# EAGLE design motor_shield (EAGLE 7.2.0)
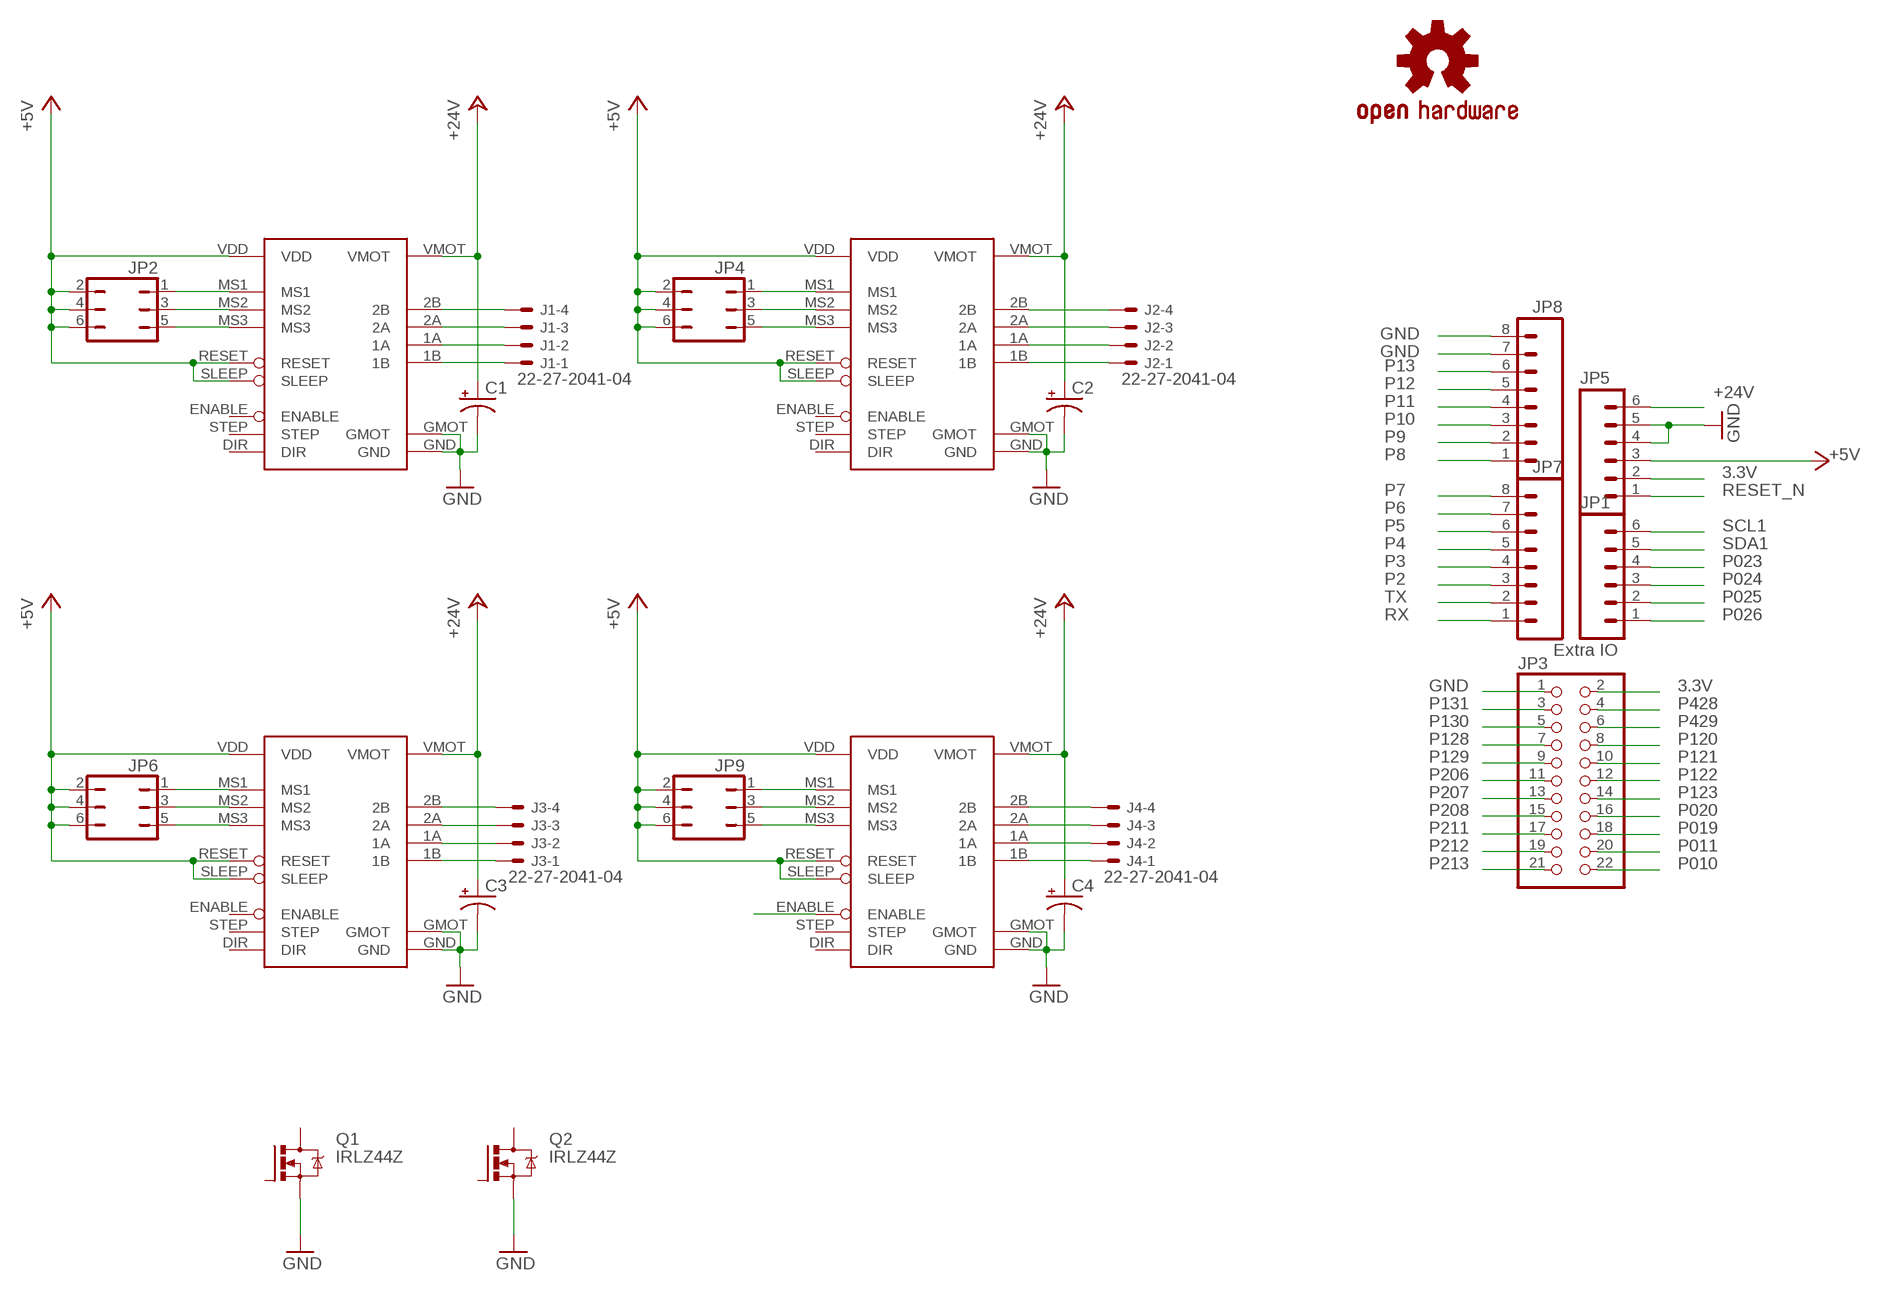
[diagram p0: schematic, sheet 1]

## Parts
C1  CAP_POLPTH1  [CPOL-RADIAL-100UF-25V]
C2  CAP_POLPTH1  [CPOL-RADIAL-100UF-25V]
C3  CAP_POLPTH1  [CPOL-RADIAL-100UF-25V]
C4  CAP_POLPTH1  [CPOL-RADIAL-100UF-25V]
J1  22-27-2041-04  [6410-04]
J2  22-27-2041-04  [6410-04]
J3  22-27-2041-04  [6410-04]
J4  22-27-2041-04  [6410-04]
JP1  M06SIP  [1X06]
JP2  JP3Q  [JP3Q]
JP3  PINHD-2X11  [2X11]
JP4  JP3Q  [JP3Q]
JP5  M06SIP  [1X06]
JP6  JP3Q  [JP3Q]
JP7  M08  [1X08]
JP8  M08  [1X08]
JP9  JP3Q  [JP3Q]
OPENHARDWARE  OSHW-LOGOL  [OSHW-LOGO-L]
Q1  IRLZ44Z  [TO220BH]
Q2  IRLZ44Z  [TO220BH]
U$1  A4988  [A4988]
U$2  A4988  [A4988]
U$3  A4988  [A4988]
U$4  A4988  [A4988]

## Nets
3.3V: JP3.2 JP5.2
+5V: JP2.2 JP2.4 JP2.6 JP4.2 JP4.4 JP4.6 JP5.3 JP6.2 JP6.4 JP6.6 JP9.2 JP9.4 JP9.6 U$1.RESET U$1.SLEEP U$1.VDD U$2.RESET U$2.SLEEP U$2.VDD U$3.RESET U$3.SLEEP U$3.VDD U$4.RESET U$4.SLEEP U$4.VDD
+24V: C1.1(+) C2.1(+) C3.1(+) C4.1(+) JP5.6 U$1.VMOT U$2.VMOT U$3.VMOT U$4.VMOT
GND: C1.2(-) C2.2(-) C3.2(-) C4.2(-) JP3.1 JP5.4 JP5.5 JP8.7 JP8.8 Q1.S Q2.S U$1.GMOT U$1.GND U$2.GMOT U$2.GND U$3.GMOT U$3.GND U$4.GMOT U$4.GND
N$1: J1.4 U$1.2B
N$2: J1.3 U$1.2A
N$3: J1.2 U$1.1A
N$4: J1.1 U$1.1B
N$5: JP2.1 U$1.MS1
N$6: JP2.3 U$1.MS2
N$7: JP2.5 U$1.MS3
N$8: J2.4 U$2.2B
N$9: J2.3 U$2.2A
N$10: J2.2 U$2.1A
N$11: J2.1 U$2.1B
N$12: JP6.1 U$3.MS1
N$13: JP6.3 U$3.MS2
N$14: JP6.5 U$3.MS3
N$15: J3.4 U$3.2B
N$16: J3.3 U$3.2A
N$17: J3.2 U$3.1A
N$18: J3.1 U$3.1B
N$20: JP9.5 U$4.MS3
N$21: JP9.3 U$4.MS2
N$22: J4.4 U$4.2B
N$23: J4.3 U$4.2A
N$24: J4.2 U$4.1A
N$25: J4.1 U$4.1B
N$26: JP9.1 U$4.MS1
N$27: JP4.1 U$2.MS1
N$28: JP4.3 U$2.MS2
N$29: JP4.5 U$2.MS3
P2: JP7.3
P3: JP7.4
P4: JP7.5
P5: JP7.6
P6: JP7.7
P7: JP7.8
P8: JP8.1
P9: JP8.2
P10: JP8.3
P010: JP3.22
P11: JP8.4
P011: JP3.20
P12: JP8.5
P13: JP8.6
P019: JP3.18
P020: JP3.16
P023: JP1.4
P024: JP1.3
P025: JP1.2
P026: JP1.1 U$4.ENABLE
P120: JP3.8
P121: JP3.10
P122: JP3.12
P123: JP3.14
P128: JP3.7
P129: JP3.9
P130: JP3.5
P131: JP3.3
P206: JP3.11
P207: JP3.13
P208: JP3.15
P211: JP3.17
P212: JP3.19
P213: JP3.21
P428: JP3.4
P429: JP3.6
RESET_N: JP5.1
RX: JP7.1
SCL1: JP1.6
SDA1: JP1.5
TX: JP7.2
Unconnected: Q1.D Q1.G Q2.D Q2.G U$1.DIR U$1.ENABLE U$1.STEP U$2.DIR U$2.ENABLE U$2.STEP U$3.DIR U$3.ENABLE U$3.STEP U$4.DIR U$4.STEP

## Notes on the sheet
- Extra IO

## Library data of the parts
C1-C4 = SparkFun:CAP_POL: Capacitor Polarized These are standard SMD and PTH capacitors. Normally 10uF, 47uF, and 100uF in electrolytic and tantalum varieties. Always verify the external diameter of the through hole cap, it varies with capacity, voltage, and manufacturer. The EIA devices should be standard.
J1-J4 = con-molex:22-?-04: CONNECTOR wire to board 2.54 mm (.1 inch) pitch header; OC_FARNELL: unknown; OC_NEWARK: unknown
JP1 JP5 = SparkFun:M06: Header 6 Standard 6-pin 0.1" header. Use with straight break away headers (SKU : PRT-00116), right angle break away headers (PRT-00553), swiss pins (PRT-00743), machine pins (PRT-00117), and female headers (PRT-00115). Molex polarized connector foot print use with SKU : PRT-08094 with associated crimp pins and housings. NOTES ON THE VARIANTS LOCK and LOCK_LONGPADS... This footprint was designed to help hold the alignment of a through-hole component (i.e. 6-pin header) while soldering it into place. You may notice that each hole has been shifted either up or down by 0.005 of an inch from it's more standard position (which is a perfectly straight line). This slight alteration caused the pins (the squares in the middle) to touch the edges of the holes. Because they are alternating, it causes a "brace" to hold the component in place. 0.005 has proven to be the perfect amount of "off-center" position when using our standard breakaway headers. Although looks a little odd when you look at the bare footprint, once you have a header in there, the alteration is very hard to notice. Also, if you push a header all the way into place, it is covered up entirely on the bottom side. This idea of altering the position of holes to aid alignment will be further integrated into the Sparkfun Library for other footprints. It can help hold any component with 3 or more connection pins.
JP2 JP4 JP6 JP9 = jumper:JP3Q: JUMPER
JP3 = pinhead:PINHD-2X11: PIN HEADER
JP7 JP8 = SparkFun:M08: Header 8 Standard 8-pin 0.1" header. Use with straight break away headers (SKU : PRT-00116), right angle break away headers (PRT-00553), swiss pins (PRT-00743), machine pins (PRT-00117), and female headers (PRT-00115).
OPENHARDWARE = SparkFun:OSHW-LOGO: Open Source Hardware Logo This logo indicates the piece of hardware it is found on incorporates a OSHW license and/or adheres to the definition of open source hardware found here: http://freedomdefined.org/OSHW
Q1 Q2 = transistor-power:IRLZ44Z: N-Channel HEXFET® Power MOSFET Logic Level AUTOMOTIVE MOSFET Source: http://www.irf.com/product-info/datasheets/data/irlz44zpbf.pdf
U$1-U$4 = A4988:A4988

## Board
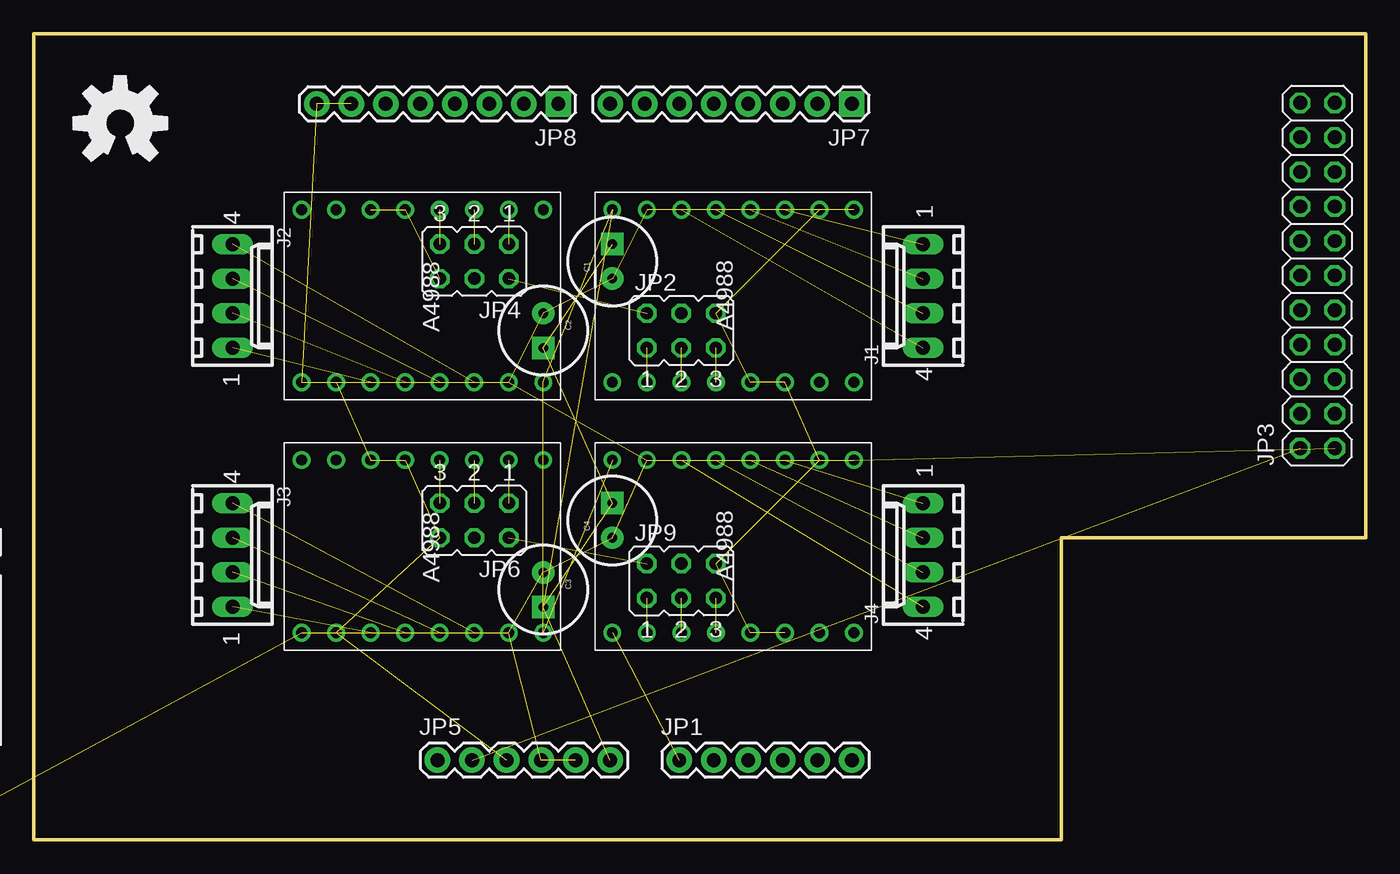
[diagram p1: board, top side]
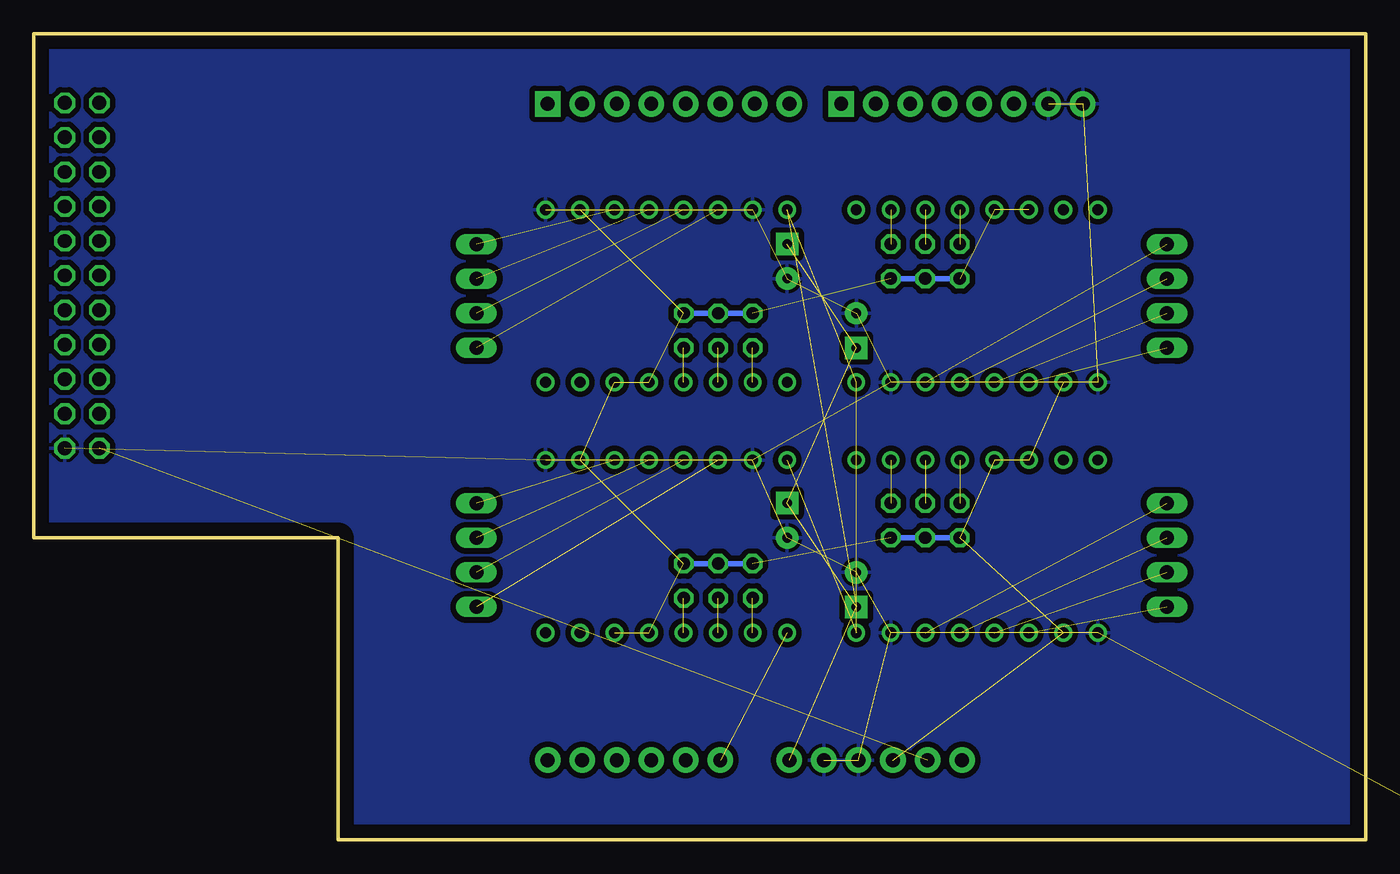
[diagram p2: board, bottom side, seen from below]

Size 97.96 x 59.27 mm. Coordinates in mm from the lower left corner, seen from the top.
Outline: 0,0 0,59.27 97.95,59.27 97.95,22.23 75.56,22.23 75.56,0 0,0
Copper layers (1*16): Top 0.035mm / dielectric 1.5mm / Bottom 0.035mm
Design rules "default *": minimum track width 10mil, minimum drill 24mil, track to track 8mil, track to pad 8mil, pad to pad 10mil, via to via 8mil, smd to smd 8mil, copper to edge 40mil, drill to drill 8mil, minimum pad ring 10mil, minimum via ring 8mil, stop-mask expansion 4mil, vias tented up to drill 0mil, thermal gap 10mil

### Footprints (pad centres in the part's own frame; a part is rotated, then mirrored left to right if it is on the bottom)
CPOL-RADIAL-100UF-25V = drill 0.7 pad 1.651 square: 1 1.27,0 | drill 0.7 pad 1.651: 2 -1.27,0
6410-04 = drill 1.016 long: 1 3.81,0; 2 1.27,0; 3 -1.27,0; 4 -3.81,0
1X06 = drill 1.016 pad 1.88: 1 0,0; 2 2.54,0; 3 5.08,0; 4 7.62,0; 5 10.16,0; 6 12.7,0
JP3Q = drill 0.914 octagon: 1 -2.54,-1.27; 2 -2.54,1.27; 3 0,-1.27; 4 0,1.27; 5 2.54,-1.27; 6 2.54,1.27
2X11 = drill 1.016 octagon: 1 -12.7,-1.27; 2 -12.7,1.27; 3 -10.16,-1.27; 4 -10.16,1.27; 5 -7.62,-1.27; 6 -7.62,1.27; 7 -5.08,-1.27; 8 -5.08,1.27; 9 -2.54,-1.27; 10 -2.54,1.27; 11 0,-1.27; 12 0,1.27; 13 2.54,-1.27; 14 2.54,1.27; 15 5.08,-1.27; 16 5.08,1.27; 17 7.62,-1.27; 18 7.62,1.27; 19 10.16,-1.27; 20 10.16,1.27; 21 12.7,-1.27; 22 12.7,1.27
1X08 = drill 1.016 pad 1.88 square: 1 0,0 | drill 1.016 pad 1.88: 2 2.54,0; 3 5.08,0; 4 7.62,0; 5 10.16,0; 6 12.7,0; 7 15.24,0; 8 17.78,0
TO220BH = drill 1.118 long: D 0,-6.35; G -2.54,-6.35; S 2.54,-6.35 | hole 3.302: 0,11.176
A4988 = drill 0.8: 1A 6.35,-1.27; 1B 6.35,-3.81; 2A 6.35,1.27; 2B 6.35,3.81; DIR -6.35,-8.89; ENABLE -6.35,8.89; GMOT 6.35,6.35; GND 6.35,-8.89; MS1 -6.35,6.35; MS2 -6.35,3.81; MS3 -6.35,1.27; RESET -6.35,-1.27; SLEEP -6.35,-3.81; STEP -6.35,-6.35; VDD 6.35,-6.35; VMOT 6.35,8.89

### Placement (x,y rotation side)
C1  42.55,42.55 90 top
C2  37.47,37.47 270 top
C3  37.47,18.41 270 top
C4  42.55,23.5 90 top
J1  65.41,40.01 90 top
J2  14.61,40.01 270 top
J3  14.61,20.95 270 top
J4  65.41,20.95 90 top
JP1  47.47,5.87 0 top
JP2  47.62,37.47 0 top
JP3  94.42,41.51 90 top
JP4  32.38,42.55 180 top
JP5  29.69,5.87 0 top
JP6  32.38,23.5 180 top
JP7  60.17,54.13 180 top
JP8  38.58,54.13 180 top
JP9  47.62,19.05 0 top
OPENHARDWARE  6.35,52.7 0 top
Q1  -7.62,8.26 0 top  (outside the outline)
Q2  -19.68,8.26 0 top  (outside the outline)
U$1  51.44,40.01 90 top
U$2  28.57,40.01 270 top
U$3  28.57,21.59 270 top
U$4  51.44,21.59 90 top

### Tracks (layer width: path | path; a pad name or v marks a point on that pad's centre or on a via)
3.3V  (1 unrouted)
+5V  (16 unrouted)
  Bottom 0.406: JP4.2 JP4.4 JP4.6 | JP6.6 JP6.4 JP6.2 | JP2.2 JP2.4 JP2.6 | JP9.6 JP9.4 JP9.2
+24V  (8 unrouted)
GND  (18 unrouted)
  pour Bottom (isolate 0.406): -0.64,-0.64 76.2,-0.64 76.2,21.59 98.42,21.59 98.42,59.69 -0.64,59.69
N$1  (1 unrouted)
N$2  (1 unrouted)
N$3  (1 unrouted)
N$4  (1 unrouted)
N$5  (1 unrouted)
N$6  (1 unrouted)
N$7  (1 unrouted)
N$8  (1 unrouted)
N$9  (1 unrouted)
N$10  (1 unrouted)
N$11  (1 unrouted)
N$12  (1 unrouted)
N$13  (1 unrouted)
N$14  (1 unrouted)
N$15  (1 unrouted)
N$16  (1 unrouted)
N$17  (1 unrouted)
N$18  (1 unrouted)
N$20  (1 unrouted)
N$21  (1 unrouted)
N$22  (1 unrouted)
N$23  (1 unrouted)
N$24  (1 unrouted)
N$25  (1 unrouted)
N$26  (1 unrouted)
N$27  (1 unrouted)
N$28  (1 unrouted)
N$29  (1 unrouted)
P026  (1 unrouted)